# Altium schematic sheet LED and Relay.SchDoc
size A
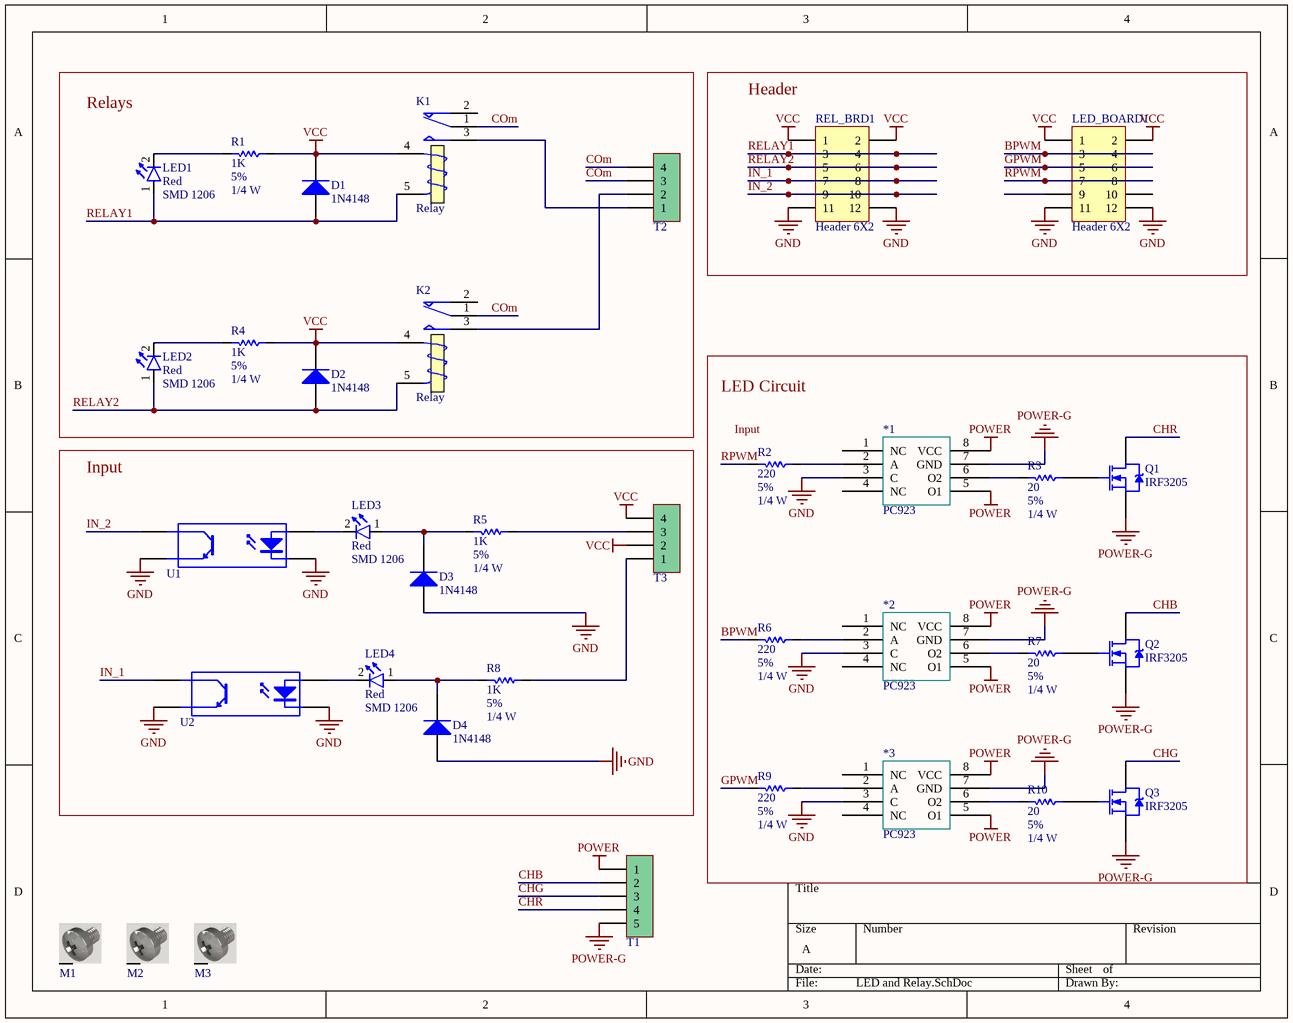
[diagram p0: LED and Relay.SchDoc]

## Parts
*1  PC923  [PC923]
*2  PC923  [PC923]
*3  PC923  [PC923]
D1  1N4148  [LL4148]
D2  1N4148  [LL4148]
D3  1N4148  [LL4148]
D4  1N4148  [LL4148]
K1  Relay  [Relay 15.40x12.10x13.10]
K2  Relay  [Relay 15.40x12.10x13.10]
LED1  Size: SMD 1206  [LED SMD 1206]  (hidden comment: Red)
LED2  Size: SMD 1206  [LED SMD 1206]  (hidden comment: Red)
LED3  Size: SMD 1206  [LED SMD 1206]  (hidden comment: Red)
LED4  Size: SMD 1206  [LED SMD 1206]  (hidden comment: Red)
LED_BOARD1  Header 6X2  [HDR2X6]
M1  Screw  [Board Screw_No Silk]  (value not drawn)
M2  Screw  [Board Screw_No Silk]  (value not drawn)
M3  Screw  [Board Screw_No Silk]  (value not drawn)
Q1  IRF3205  [TO-220AB]
Q2  IRF3205  [TO-220AB]
Q3  IRF3205  [TO-220AB]
R1  Tolerance: 5%  Power: 1/4 W  [RES 1206 (3216X08L)]  (hidden comment: 1K)
R2  Tolerance: 5%  Power: 1/4 W  [RES 1206 (3216X08L)]  (hidden comment: 220)
R3  Tolerance: 5%  Power: 1/4 W  [RES 1206 (3216X08L)]  (hidden comment: 20)
R4  Tolerance: 5%  Power: 1/4 W  [RES 1206 (3216X08L)]  (hidden comment: 1K)
R5  Tolerance: 5%  Power: 1/4 W  [RES 1206 (3216X08L)]  (hidden comment: 1K)
R6  Tolerance: 5%  Power: 1/4 W  [RES 1206 (3216X08L)]  (hidden comment: 220)
R7  Tolerance: 5%  Power: 1/4 W  [RES 1206 (3216X08L)]  (hidden comment: 20)
R8  Tolerance: 5%  Power: 1/4 W  [RES 1206 (3216X08L)]  (hidden comment: 1K)
R9  Tolerance: 5%  Power: 1/4 W  [RES 1206 (3216X08L)]  (hidden comment: 220)
R10  Tolerance: 5%  Power: 1/4 W  [RES 1206 (3216X08L)]  (hidden comment: 20)
REL_BRD1  Header 6X2  [HDR2X6]
T1  Phoenix terminal  [phoenix terminal 5]  (value not drawn)
T2  Phoenix terminal  [phoenix terminal 4]  (value not drawn)
T3  Phoenix terminal  [phoenix terminal 4]  (value not drawn)
U1  Optoisolator  [My_opto]  (value not drawn)
U2  Optoisolator  [My_opto]  (value not drawn)

## Nets
GND: *1.3(C) *2.3(C) *3.3(C) D3.1(A) D4.1(A) LED_BOARD1.11 LED_BOARD1.12 REL_BRD1.11 REL_BRD1.12 U1.2(K) U1.4(E) U2.2(K) U2.4(E)
POWER: *1.5(O1) *1.8(VCC) *2.5(O1) *2.8(VCC) *3.5(O1) *3.8(VCC) T1.1
POWER-G: *1.7(GND) *2.7(GND) *3.7(GND) Q1.3(S) Q2.3(S) Q3.3(S) T1.5
VCC: D1.2(K) D2.2(K) K1.4(T1) K2.4(T1) LED_BOARD1.1 LED_BOARD1.2 R1.1 R4.1 REL_BRD1.1 REL_BRD1.2 T3.2 T3.4
BPWM: LED_BOARD1.3 LED_BOARD1.4 R6.2
CHB: Q2.2(D) T1.2
CHG: Q3.2(D) T1.3
CHR: Q1.2(D) T1.4
COm: K1.1(COM) K2.1(COM) T2.3 T2.4
GPWM: LED_BOARD1.5 LED_BOARD1.6 R9.2
IN_1: REL_BRD1.7 REL_BRD1.8 U2.3(C)
IN_2: REL_BRD1.9 REL_BRD1.10 U1.3(C)
RELAY1: D1.1(A) K1.5(T2) LED1.1(A) REL_BRD1.3 REL_BRD1.4
RELAY2: D2.1(A) K2.5(T2) LED2.1(A) REL_BRD1.5 REL_BRD1.6
RPWM: LED_BOARD1.7 LED_BOARD1.8 R2.2
Net*1_2: *1.2(A) R2.1
Net*1_6: *1.6(O2) R3.2
Net*2_2: *2.2(A) R6.1
Net*2_6: *2.6(O2) R7.2
Net*3_2: *3.2(A) R9.1
Net*3_6: *3.6(O2) R10.2
NetD3_2: D3.2(K) LED3.1(A) R5.1
NetD4_2: D4.2(K) LED4.1(A) R8.1
NetK1_3: K1.3(NO) T2.1
NetK2_3: K2.3(NO) T2.2
NetLED1_2: LED1.2(K) R1.2
NetLED2_2: LED2.2(K) R4.2
NetLED3_2: LED3.2(K) U1.1(A)
NetLED4_2: LED4.2(K) U2.1(A)
NetQ1_1: Q1.1(G) R3.1
NetQ2_1: Q2.1(G) R7.1
NetQ3_1: Q3.1(G) R10.1
NetR5_2: R5.2 T3.3
NetR8_2: R8.2 T3.1

Not connected (* = marked no-connect by the designer): *1 1(NC) 4(NC); *2 1(NC) 4(NC); *3 1(NC) 4(NC); K1 2(NC); K2 2(NC); LED_BOARD1 9 10; M1 S; M2 S; M3 S

## Notes on the sheet
- Labels drawn without touching a wire or pin: Header, Input, LED Circuit, Relays

## Library data of the parts
D1-D4 = Diode 1N4148: High Conductance Fast Diode; Published: 8-Jun-2000; LatestRevisionDate: 17-Jul-2002; LatestRevisionNote: Re-released for DXP Platform.; DatasheetVersion: 1997; PackageReference: DO-35; Publisher: Altium Limited; PackageDescription: Diode, Axial; Body 3.8 x 1.9 mm (LxDia. max), Lead Dia. 0.53 mm (max); Code_JEDEC: DO-204-AH; ComponentLink1Description: Manufacturer Link; ComponentLink1URL: http://www.fairchildsemi.com/; ComponentLink2Description: Datasheet; ComponentLink2URL: http://www.fairchildsemi.com/ds/1N%2F1N4148.pdf
K1 K2 = Relay: SPDT Relay; Designer: Eng. Saeid Jorablo; Company: E.P.I.L; Design_Date: 2011/10/31
LED1-LED4 = LED: Designer: Saeid Jorablo; Organazation: ControTec; Adding Date: 1387/12/22; Color: Red
LED_BOARD1 REL_BRD1 = Header 6X2: Header, 6-Pin, Dual row; Revision: 17-Jul-2002: Re-released for DXP Platform.; Publisher: Altium Limited
M1-M3 = Board Screw: Board Screw With Spacer
Q1-Q3 = IRF3205: HEXFET Power MOSFET; Note: Pin 2 is electrically connected to pin 4.; Published: 8-Jun-2000; LatestRevisionDate: 17-Jul-2002; LatestRevisionNote: Re-released for DXP Platform.; DatasheetVersion: Aug-1997; PackageVersion: Feb-1997; PackageReference: TO-220AB; Publisher: Altium Limited; PackageDescription: TO, Thru-Hole, Vertical, Heatsink Mounted; 3 In-Line Leads; Pitch 2.54 mm; ComponentLink1Description: Manufacturer Link; ComponentLink1URL: http://www.irf.com/; ComponentLink2Description: Datasheet; ComponentLink2URL: http://www.irf.com/product-info/datasheets/data/irf3205.pdf
R1-R10 = Resistor
  R1 R4 R5 R8: Value: 1K
  R2 R6 R9: Value: 220
  R3 R7 R10: Value: 20
T1 = Phoenix terminal 5: Terminal 5 Pin; Designer: Seyed Mohsen Ghasemain; E-mail: picpars@gmail.com; ComponentLinkURL: www.picpars.com
T2 T3 = Phoenix terminal 4: Terminal 4 Pin; Designer: Seyed Mohsen Ghasemain; E-mail: picpars@gmail.com; ComponentLinkURL: www.picpars.com